# EAGLE design I2C-7-Segment-Backpack-dot36inch (EAGLE 9.5.2)
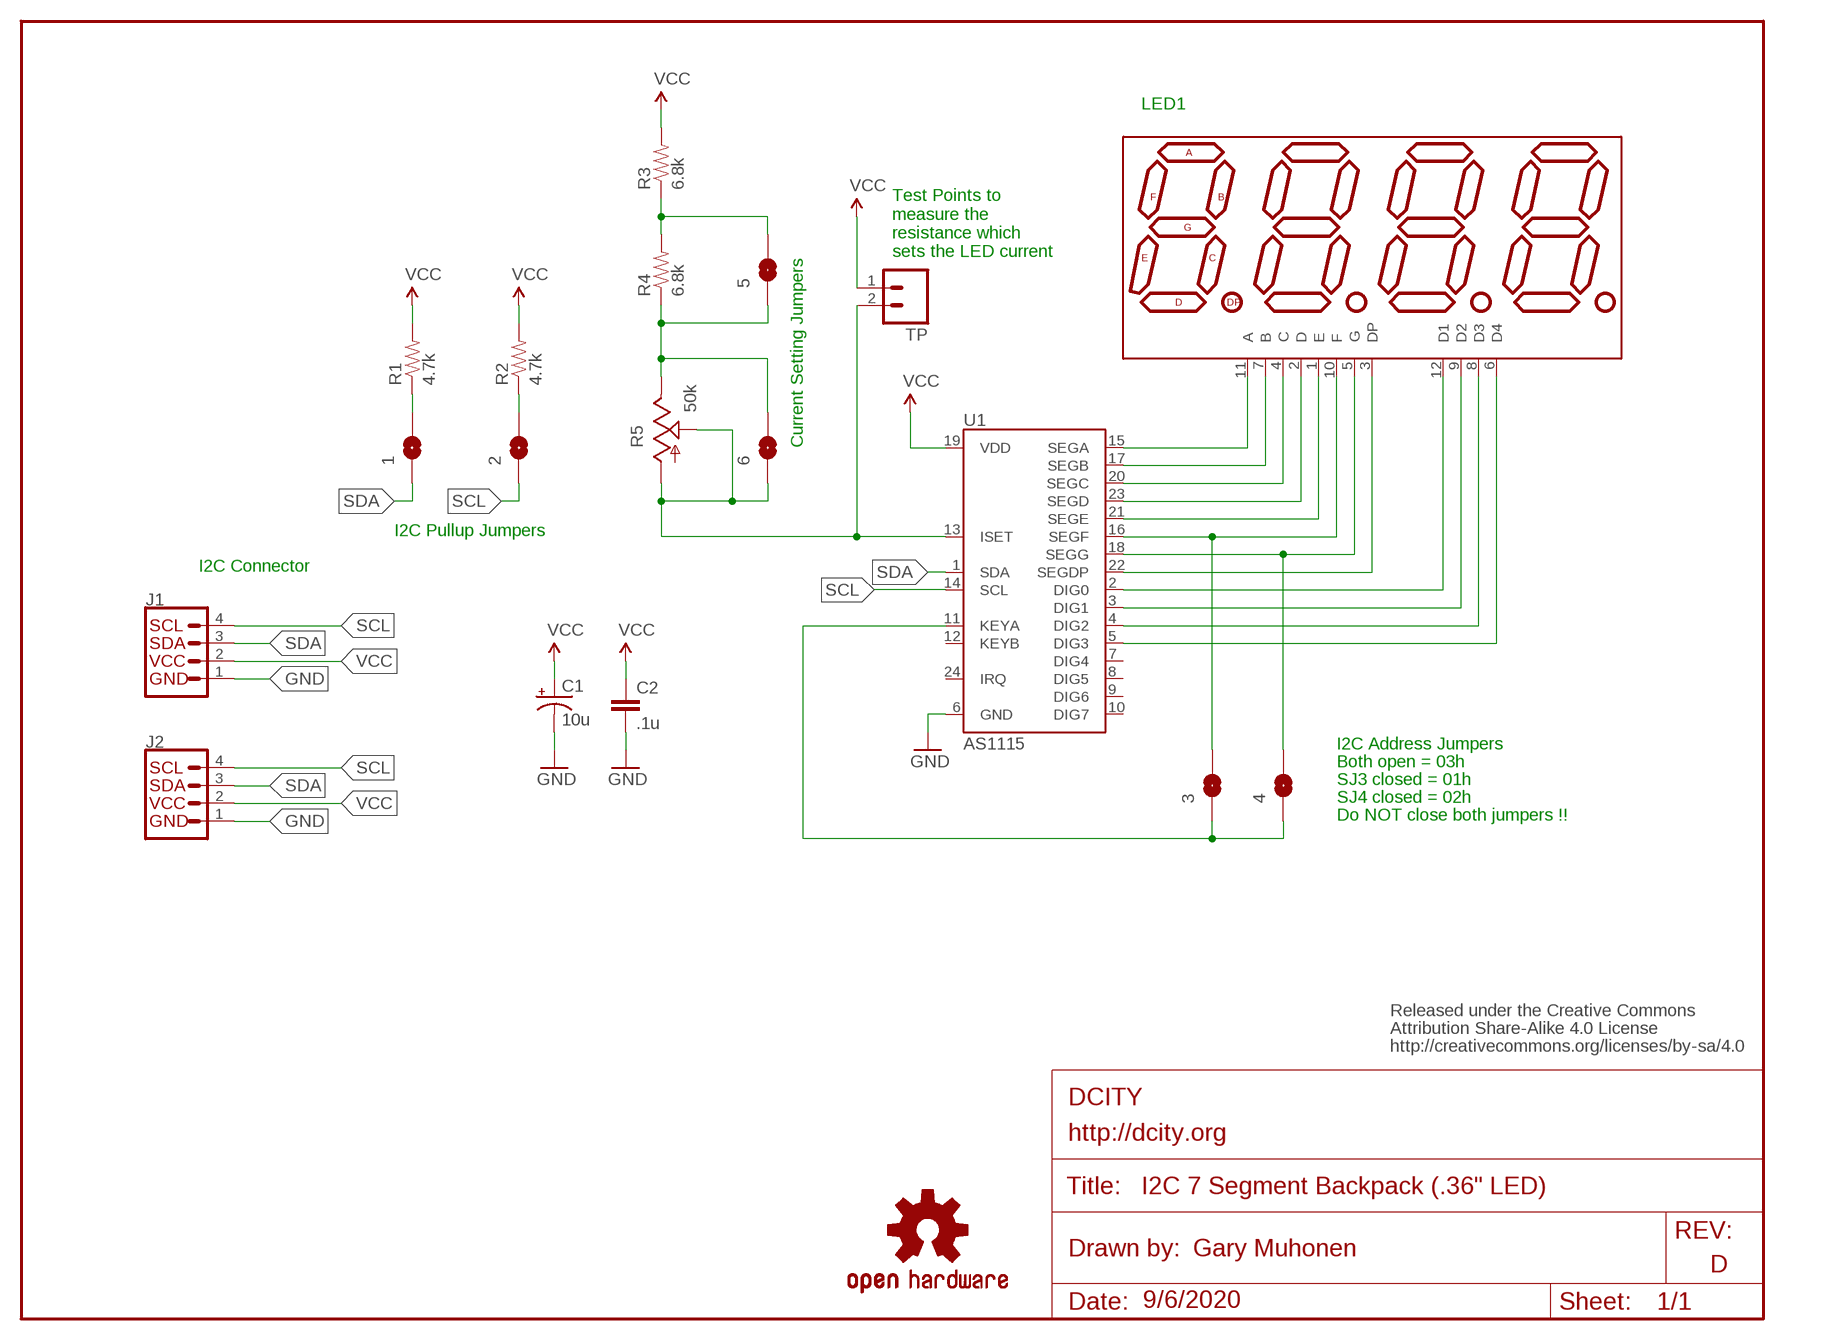
[diagram p0: schematic, sheet 1]
U$1 (DOCFIELD-WHT): COMPANYNAME: DCITY; COMPANYWEBSITE: http://dcity.org; DATE: 9/6/2020; DRAWNBY: Gary Muhonen; TITLE: I2C 7 Segment Backpack (.36" LED); VERSION: D

## Parts
1  SOLDERJUMPERNO  [SJ_2S-NO]
2  SOLDERJUMPERNO  [SJ_2S-NO]
3  SOLDERJUMPERNO  [SJ_2S-NO]
4  SOLDERJUMPERNO  [SJ_2S-NO]
5  SOLDERJUMPERNO  [SJ_2S-NO]
6  SOLDERJUMPERNO  [SJ_2S-NO]
C1  10u  CAP_POL0805  [0805-POL]
C2  .1u  CAP0805  [0805-CAP]
DISP1  LED1  7-SEGMENT-4DIGIT-COUNTER-PT4  [7-SEGMENT-4DIGIT-PT4]
J1  QWIIC_RIGHT_ANGLE  QWIIC_CONNECTORJS-1MM  [JST04_1MM_RA]
J2  QWIIC_RIGHT_ANGLE  QWIIC_CONNECTORJS-1MM  [JST04_1MM_RA]
LOGO1  OSHW-LOGOS  [OSHW-LOGO-S]
R1  4.7k  RESISTOR0805  [0805-RES]
R2  4.7k  RESISTOR0805  [0805-RES]
R3  6.8k  RESISTOR0805  [0805-RES]
R4  6.8k  RESISTOR0805  [0805-RES]
R5  50k  POT-TC33X  [POT-TC33X]
TP  M02PTH  [1X02]
U1  AS1115  AS1115-NO-HS  [TSSOP24-NO-HS]
U$4  CREATIVE_COMMONS  [CREATIVE_COMMONS]

## Nets
GND: C1.- C2.2 J1.1 J2.1 U1.6(GND)
N$1: DISP1.11(A) U1.15(SEGA)
N$2: DISP1.7(B) U1.17(SEGB)
N$3: DISP1.4(C) U1.20(SEGC)
N$4: DISP1.2(D) U1.23(SEGD)
N$5: DISP1.1(E) U1.21(SEGE)
N$6: 3.2 DISP1.10(F) U1.16(SEGF)
N$7: 4.2 DISP1.5(G) U1.18(SEGG)
N$8: DISP1.3(DP) U1.22(SEGDP)
N$9: DISP1.12(D1) U1.2(DIG0)
N$10: DISP1.9(D2) U1.3(DIG1)
N$11: DISP1.8(D3) U1.4(DIG2)
N$12: DISP1.6(D4) U1.5(DIG3)
N$13: 3.1 4.1 U1.11(KEYA)
N$14: 6.1 R5.1(A) R5.2(S) TP.2 U1.13(ISET)
N$15: 5.1 6.2 R4.1 R5.3(E)
N$16: 5.2 R3.1 R4.2
N$20: 1.2 R1.1
N$21: 2.2 R2.1
SCL: 2.1 J1.4 J2.4 U1.14(SCL)
SDA: 1.1 J1.3 J2.3 U1.1(SDA)
VCC: C1.+ C2.1 J1.2 J2.2 R1.2 R2.2 R3.2 TP.1 U1.19(VDD)
Unconnected: U1.7(DIG4) U1.8(DIG5) U1.9(DIG6) U1.10(DIG7) U1.12(KEYB) U1.24(IRQ)

## Notes on the sheet
- LED1
- Test Points to
  measure the
  resistance which
  sets the LED current
- Current Setting Jumpers
- I2C Pullup Jumpers
- I2C Connector
- I2C Address Jumpers
- Both open = 03h
- SJ3 closed = 01h
- SJ4 closed = 02h
- Do NOT close both jumpers !!

## Library data of the parts
1-6 = 0:SOLDERJUMPER: Solder Jumper Standard SMD solder jumper. Used to automate production. Two varients : Normally Open and Normally Closed are the same, but have different paste layers. NC will have a large amount of paste and should jumper during reflow.
C1 = 0:CAP_POL: Capacitor Polarized These are standard SMD and PTH capacitors. Normally 10uF, 47uF, and 100uF in electrolytic and tantalum varieties. Always verify the external diameter of the through hole cap, it varies with capacity, voltage, and manufacturer. The EIA devices should be standard.
C2 = 0:CAP: Capacitor Standard 0603 ceramic capacitor, and 0.1" leaded capacitor.
DISP1 = 0:7-SEGMENT-4DIGIT-COUNTER
J1 J2 = 0:QWIIC_CONNECTOR: SparkFun I2C Standard Qwiic Connector An SMD 1mm pitch JST connector makes it easy and quick (get it? Qwiic?) to connect I2C devices to each other. The Qwiic system <http://www.sparkfun.com/qwiic> enables fast and solderless connection between popular platforms and various sensors and actuators. We carry 200mm <https://www.sparkfun.com/products/14204>, 100mm <https://www.sparkfun.com/products/14205>, 50mm <https://www.sparkfun.com/products/14206>, and breadboard friendly <https://www.sparkfun.com/products/14207> Qwiic cables. We also offer 10 pcs strips <https://www.sparkfun.com/products/14323> the SMD connectors.; PROD_ID: CONN-13694
LOGO1 = 0:OSHW-LOGO: Open Source Hardware Logo This logo indicates the piece of hardware it is found on incorporates a OSHW license and/or adheres to the definition of open source hardware found here: http://freedomdefined.org/OSHW
R1-R4 = 0:RESISTOR: Resistor Basic schematic elements and footprints for 0603, 1206, and PTH 1/10th watt (small) resistors.
R5 = 0:POT
TP = 0:M02: Header 2 Standard 2-pin 0.1" header. Use with straight break away headers (SKU : PRT-00116), right angle break away headers (PRT-00553), swiss pins (PRT-00743), machine pins (PRT-00117), and female headers (PRT-00115). Molex polarized connector foot print use with SKU : PRT-08233 with associated crimp pins and housings.
U1 = 0:AS1115: 8 Digit 7 segment LED Driver Packages: TSSOP-24, 24-pin QFN
U$4 = 0:CREATIVE_COMMONS

## Board
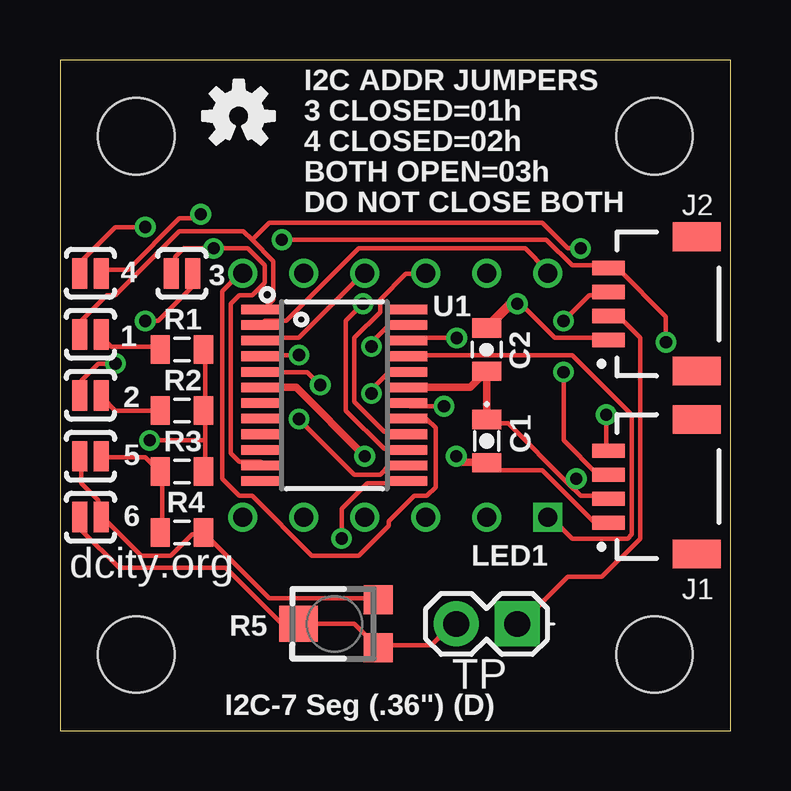
[diagram p1: board, top side]
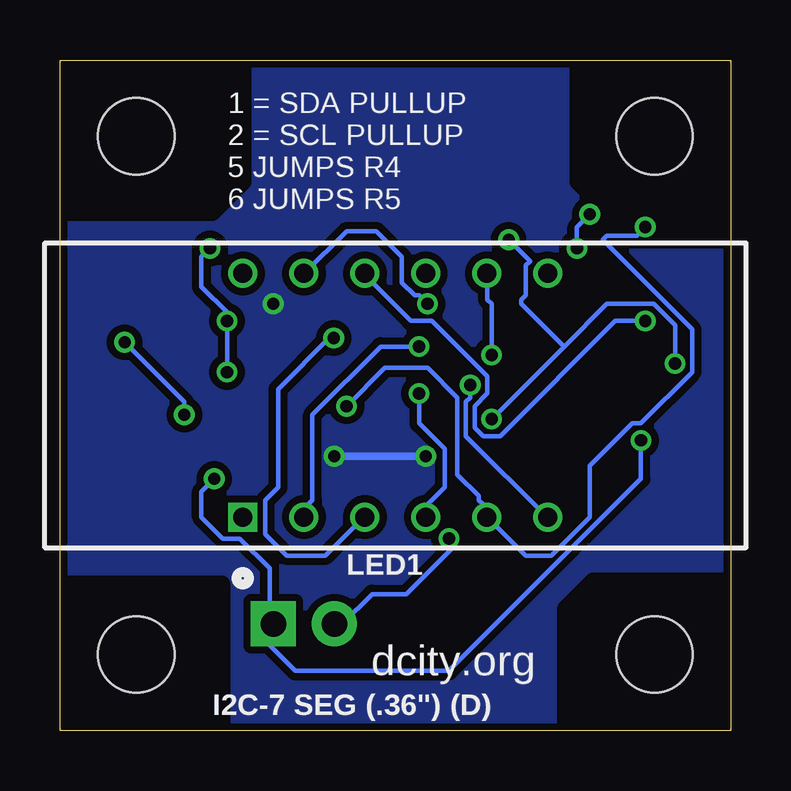
[diagram p2: board, bottom side, seen from below]

Size 27.94 x 27.94 mm. Coordinates in mm from the lower left corner, seen from the top.
Outline: 0,0 27.94,0 27.94,27.94 0,27.94 0,0
Copper layers (1*16): Top 0.035mm / dielectric 1.5mm / Bottom 0.035mm
Design rules "7mils-gary *": minimum track width 7mil, minimum drill 20mil, track to track 7mil, track to pad 7mil, pad to pad 7mil, via to via 7mil, smd to smd 7mil, copper to edge 7mil, drill to drill 7mil, minimum pad ring 7mil, minimum via ring 7mil, stop-mask expansion 4mil, vias tented up to drill 25mil, thermal gap 10mil
Holes 3.17 mm at 3.17,24.77 24.77,24.77 24.77,3.17 3.17,3.17
tRestrict: 12 lines
bRestrict: 12 lines
vRestrict: area 2.5,18.7 to 3.2,19.6; area 2.3,16 to 3,16.9; area 2.4,13.5 to 3.2,14.5; area 4.3,16.6 to 5.8,17.7; area 6.1,18.5 to 6.7,19.6; area 15.5,17.1 to 17,18.3; area 4.3,14.1 to 5.8,15.1; area 4.3,11.6 to 5.8,12.6; area 2.7,11 to 3.3,12.1; area 2.5,8.5 to 3.4,9.4; area 4.4,9 to 5.8,10; area 7,3.9 to 8.5,5; 5 more areas

### Footprints (pad centres in the part's own frame; a part is rotated, then mirrored left to right if it is on the bottom)
SJ_2S-NO = smd 0.635 x 1.27: 1 -0.45,0; 2 0.45,0
0805-POL = smd 0.8 x 1.2: + 0.9,0; - -0.9,0
0805-CAP = smd 0.8 x 1.2: 1 -0.9,0; 2 0.9,0
7-SEGMENT-4DIGIT-PT4 = drill 0.8 square: 1 -6.35,-3.81 | drill 0.8: 2 -3.81,-3.81; 3 -1.27,-3.81; 4 1.27,-3.81; 5 3.81,-3.81; 6 6.35,-3.81; 7 6.35,6.35; 8 3.81,6.35; 9 1.27,6.35; 10 -1.27,6.35; 11 -3.81,6.35; 12 -6.35,6.35
JST04_1MM_RA = smd 0.6 x 1.35: 1 -1.5,0; 2 -0.5,0; 3 0.5,0; 4 1.5,0 | smd 1.2 x 2: NC1 2.8,-3.675; NC2 -2.8,-3.675
0805-RES = smd 0.8 x 1.2: 1 -0.9,0; 2 0.9,0
POT-TC33X = smd 1.2 x 1.2: 1 -1,-1.825; 3 1,-1.825 | smd 1.5 x 1.6: 2 0,1.5
1X02 = drill 1.067 pad 1.88 square: 1 0,0 | drill 1.067 pad 1.88: 2 2.54,0
TSSOP24-NO-HS = smd 0.4 x 1.65: 1 -3.575,-3.05; 2 -2.925,-3.05; 3 -2.275,-3.05; 4 -1.625,-3.05; 5 -0.975,-3.05; 6 -0.325,-3.05; 7 0.325,-3.05; 8 0.975,-3.05; 9 1.625,-3.05; 10 2.275,-3.05; 11 2.925,-3.05; 12 3.575,-3.05; 13 3.575,3.05; 14 2.925,3.05; 15 2.275,3.05; 16 1.625,3.05; 17 0.975,3.05; 18 0.325,3.05; 19 -0.325,3.05; 20 -0.975,3.05; 21 -1.625,3.05; 22 -2.275,3.05; 23 -2.925,3.05; 24 -3.575,3.05

### Placement (x,y rotation side)
1  1.27,16.51 0 top
2  1.27,13.97 0 top
3  5.08,19.05 0 top
4  1.27,19.05 180 top
5  1.27,11.43 0 top
6  1.27,8.89 0 top
C1  17.78,12.06 90 top
C2  17.78,15.88 90 top
DISP1  13.97,12.7 0 bottom
J1  22.86,10.16 90 top
J2  22.86,17.78 90 top
LOGO1  7.44,25.6 0 top
R1  5.08,15.88 0 top
R2  5.08,13.34 0 top
R3  5.08,10.79 0 top
R4  5.08,8.26 180 top
R5  11.43,4.45 90 top
TP  19.05,4.45 180 top
U1  11.43,13.97 270 top
U$4  0,29.21 0 top

### Tracks (layer width: path | path; a pad name or v marks a point on that pad's centre or on a via)
GND  (via drill 0.51)
  Top 0.178: J1.1 22.76,8.71 22.23,8.71 20.09,10.85 18.14,10.85 C1.- | J2.1 22.76,16.36 20.62,16.36 19.2,17.78 v19.05,17.78
  Top 0.305: U1.6 9.84,14.29 v12.7,11.43 | v16.51,11.43 16.76,11.18 17.77,11.18 C1.-
  Top 0.406: 17.98,10.97 C1.- | v19.05,17.78 18.79,17.78 C2.2
  Bottom 0.305: v12.7,11.43 v16.51,11.43
  pour Bottom (isolate 0.305): 0,27.94 27.94,27.94 27.94,0 0,0
N$1  (via drill 0.51)
  Top 0.178: v12.62,17.78 11.91,17.07 11.91,13.34 13.51,11.73 14.4,11.73 U1.15
  Bottom 0.178: v12.62,17.78 12.98,18.14 13.16,18.14 13.69,18.67 13.69,19.74 14.76,20.8 16,20.8 17.78,19.02 DISP1.11
N$2
  Top 0.178: U1.17 14.58,12.98 15.29,12.98 15.65,12.62 15.65,10.13 15.29,9.78 14.76,9.78 13.69,8.71 13.69,8.53 12.45,7.29 10.49,7.29 8,9.78 7.47,9.78 6.76,10.49 6.76,18.31 7.47,19.02 DISP1.7
N$3  (via drill 0.51)
  Top 0.178: v12.98,14.05 12.98,14.22 13.69,14.94 14.4,14.94 U1.20
  Bottom 0.178: v12.98,14.05 12.98,12.8 11.91,11.73 11.91,10.13 12.62,9.42 12.62,8.89 DISP1.4
N$4  (via drill 0.51)
  Top 0.178: v12.98,16 12.98,16.18 13.69,16.89 14.4,16.89 U1.23
  Bottom 0.178: v12.98,16 14.58,16 17.42,13.16 17.42,9.6 17.78,9.25 DISP1.2
N$5
  Top 0.178: U1.21 14.58,15.65 21.34,15.65 23.82,13.16 23.82,8.18 23.65,8 21.34,8 20.45,8.89 DISP1.1
N$6  (via drill 0.51)
  Top 0.178: v3.56,17.07 4.09,17.07 5.51,18.49 5.51,19.02 3.2 | U1.16 14.4,12.45 13.51,12.45 12.27,13.69 12.27,16.36 13.34,17.42 13.34,17.96 14.4,19.02 15.11,19.02 DISP1.10
  Bottom 0.178: v3.56,17.07 4.8,17.07 9.6,12.27 10.31,12.27 10.67,12.62 10.67,13.51 10.13,14.05 10.13,14.76 12.45,17.07 13.34,17.07 15.29,19.02 DISP1.10
N$7  (via drill 0.51)
  Top 0.178: v3.56,20.98 2.31,20.98 0.89,19.56 0.89,19.2 4.2 | v16,13.51 14.58,13.51 U1.18
  Bottom 0.178: v3.56,20.98 3.91,20.62 5.16,20.62 5.33,20.45 1.6,16.71 1.6,14.94 3.73,12.8 4.09,12.8 5.87,11.02 5.87,8.89 7.47,7.29 8.53,7.29 10.13,8.89 DISP1.5 10.31,8.89 10.31,9.42 10.49,9.6 10.49,9.78 11.38,10.67 11.38,13.87 12.62,15.11 14.4,15.11 v16,13.51
N$8  (via drill 0.51)
  Top 0.178: v16.54,16.36 14.58,16.36 U1.22 | 15.29,8.89 DISP1.3
  Bottom 0.178: v16.54,16.36 16.71,16.36 18.85,14.22 18.85,10.13 19.38,9.6 19.38,8.18 18.49,7.29 16.89,7.29 15.29,8.89 DISP1.3
N$9
  Top 0.178: U1.2 8.53,17.07 9.42,17.07 12.45,20.09 19.38,20.09 20.27,19.2 DISP1.12
N$10
  Top 0.178: U1.3 8.53,16.36 9.96,16.36 12.62,19.02 DISP1.9
N$11  (via drill 0.51)
  Top 0.178: v9.96,15.65 8.53,15.65 U1.4
  Bottom 0.178: v9.96,15.65 9.96,17.78 10.13,17.96 10.13,19.02 DISP1.8
N$12  (via drill 0.51)
  Top 0.178: v10.85,14.4 10.31,14.94 8.53,14.94 U1.5
  Bottom 0.178: v10.85,14.4 10.85,13.87 11.02,13.69 11.02,12.27 7.64,8.89 DISP1.6
N$13  (via drill 0.51)
  Top 0.178: v5.87,21.51 5.69,21.34 4.98,21.34 2.85,19.2 1.78,19.2 4.1 | 3.1 4.8,19.2 4.8,19.74 5.16,20.09 v6.4,20.09 7.82,20.09 8.53,19.38 8.53,18.67 8,18.14 7.47,18.14 7.11,17.78 7.11,11.56 7.47,11.2 8.36,11.2 U1.11
  Bottom 0.178: v5.87,21.51 6.4,20.98 v6.4,20.09
N$14  (via drill 0.51)
  Top 0.178: 6.1 0.89,8.89 0.89,8.36 2.46,6.78 6.91,6.78 9.25,4.45 R5.2 12.27,4.45 13.16,3.56 R5.1 13.34,3.56 15.47,3.56 16.36,4.45 TP.2 | v11.73,8 11.73,9.25 12.8,10.31 14.4,10.31 U1.13
  Bottom 0.178: v11.73,8 11.56,7.82 11.56,7.64 13.51,5.69 14.94,5.69 16.18,4.45 TP.2
N$15
  Top 0.178: R5.3 13.16,5.51 8.71,5.51 6.04,8.18 R4.1 5.87,8.18 5.51,8.18 4.62,7.29 3.38,7.29 1.78,8.89 6.2 1.6,8.89 1.6,9.6 0.89,10.31 0.89,11.38 5.1
N$16
  Top 0.178: R4.2 4.27,8.36 4.27,10.67 R3.1 4.09,10.85 3.56,11.38 1.78,11.38 5.2
N$20
  Top 0.178: R1.1 4.09,16 2.13,16 1.78,16.36 1.2
N$21
  Top 0.178: R2.1 2.31,13.34 1.78,13.87 2.2
SCL  (via drill 0.51)
  Top 0.178: v2.31,15.29 1.6,15.29 0.89,14.58 0.89,14.05 2.1 | v9.96,12.98 12.27,10.67 13.34,10.67 13.69,11.02 14.4,11.02 U1.14 | v22.76,13.16 22.76,11.73 J1.4 | v25.25,16.18 25.25,17.25 23.29,19.2 22.94,19.2 J2.4 22.76,19.38 21.34,19.38 20.27,20.45 v9.25,20.45
  Bottom 0.178: v2.31,15.29 2.31,16.89 3.2,17.78 5.16,17.78 6.93,16 | v9.96,12.98 6.93,16 | 6.93,16 8.71,17.78 8.71,17.96 8.53,18.14 8.53,19.38 8.36,19.56 v9.25,20.45 | v22.76,13.16 22.76,13.69 v25.25,16.18
SDA  (via drill 0.51)
  Top 0.178: 8,20.45 8.89,19.56 8.89,17.96 8.53,17.6 U1.1 | 8,20.45 7.64,20.8 4.98,20.8 2.31,18.14 1.96,18.14 0.89,17.07 0.89,16.54 1.1 | v20.98,14.94 20.98,12.09 22.4,10.67 22.76,10.67 J1.3 | v20.98,17.07 22.05,18.14 22.76,18.14 J2.3 | v21.69,20.09 21.16,20.09 20.09,21.16 8.71,21.16 8,20.45
  Bottom 0.178: v20.98,14.94 v20.98,17.07 20.98,17.42 22.05,18.49 22.05,19.74 v21.69,20.09
VCC  (via drill 0.51)
  Top 0.178: 6.04,12.09 6.04,13.18 R2.2 6.04,13.36 6.04,15.85 R1.2 | 6.04,12.09 6.04,10.87 R3.2 | v3.73,12.09 6.04,12.09 | 21.16,10.31 18.67,12.8 17.78,12.8 C1.+ | 21.16,10.31 21.69,9.78 22.76,9.78 J1.2 | J2.2 22.94,17.25 23.29,17.25 24.18,16.36 24.18,8 22.58,6.4 21.16,6.4 19.2,4.45 TP.1 | 21.16,10.31 21.34,10.31 v21.51,10.49
  Top 0.305: U1.19 17.1,14.29 C2.1 C1.+
  Bottom 0.178: v3.73,12.09 3.73,10.49 11.73,2.49 18.14,2.49 19.2,3.56 19.2,4.45 | v21.51,10.49 22.05,9.96 22.05,8.89 21.16,8 20.45,8 19.2,6.76 19.2,4.45 | 19.2,4.45 TP.1

### Text on the board
tPlace: I2C ADDR JUMPERS | 3 CLOSED=01h | 4 CLOSED=02h | BOTH OPEN=03h | DO NOT CLOSE BOTH | LED1 | dcity.org | I2C-7 Seg (.36") (D)
bPlace: 1 = SDA PULLUP / 2 = SCL PULLUP / 5 JUMPS R4 / 6 JUMPS R5 | LED1 | dcity.org | I2C-7 SEG (.36") (D)